# EAGLE design Cansat2019_1516_Payload_SectionA_v02 (EAGLE 7.3.0)
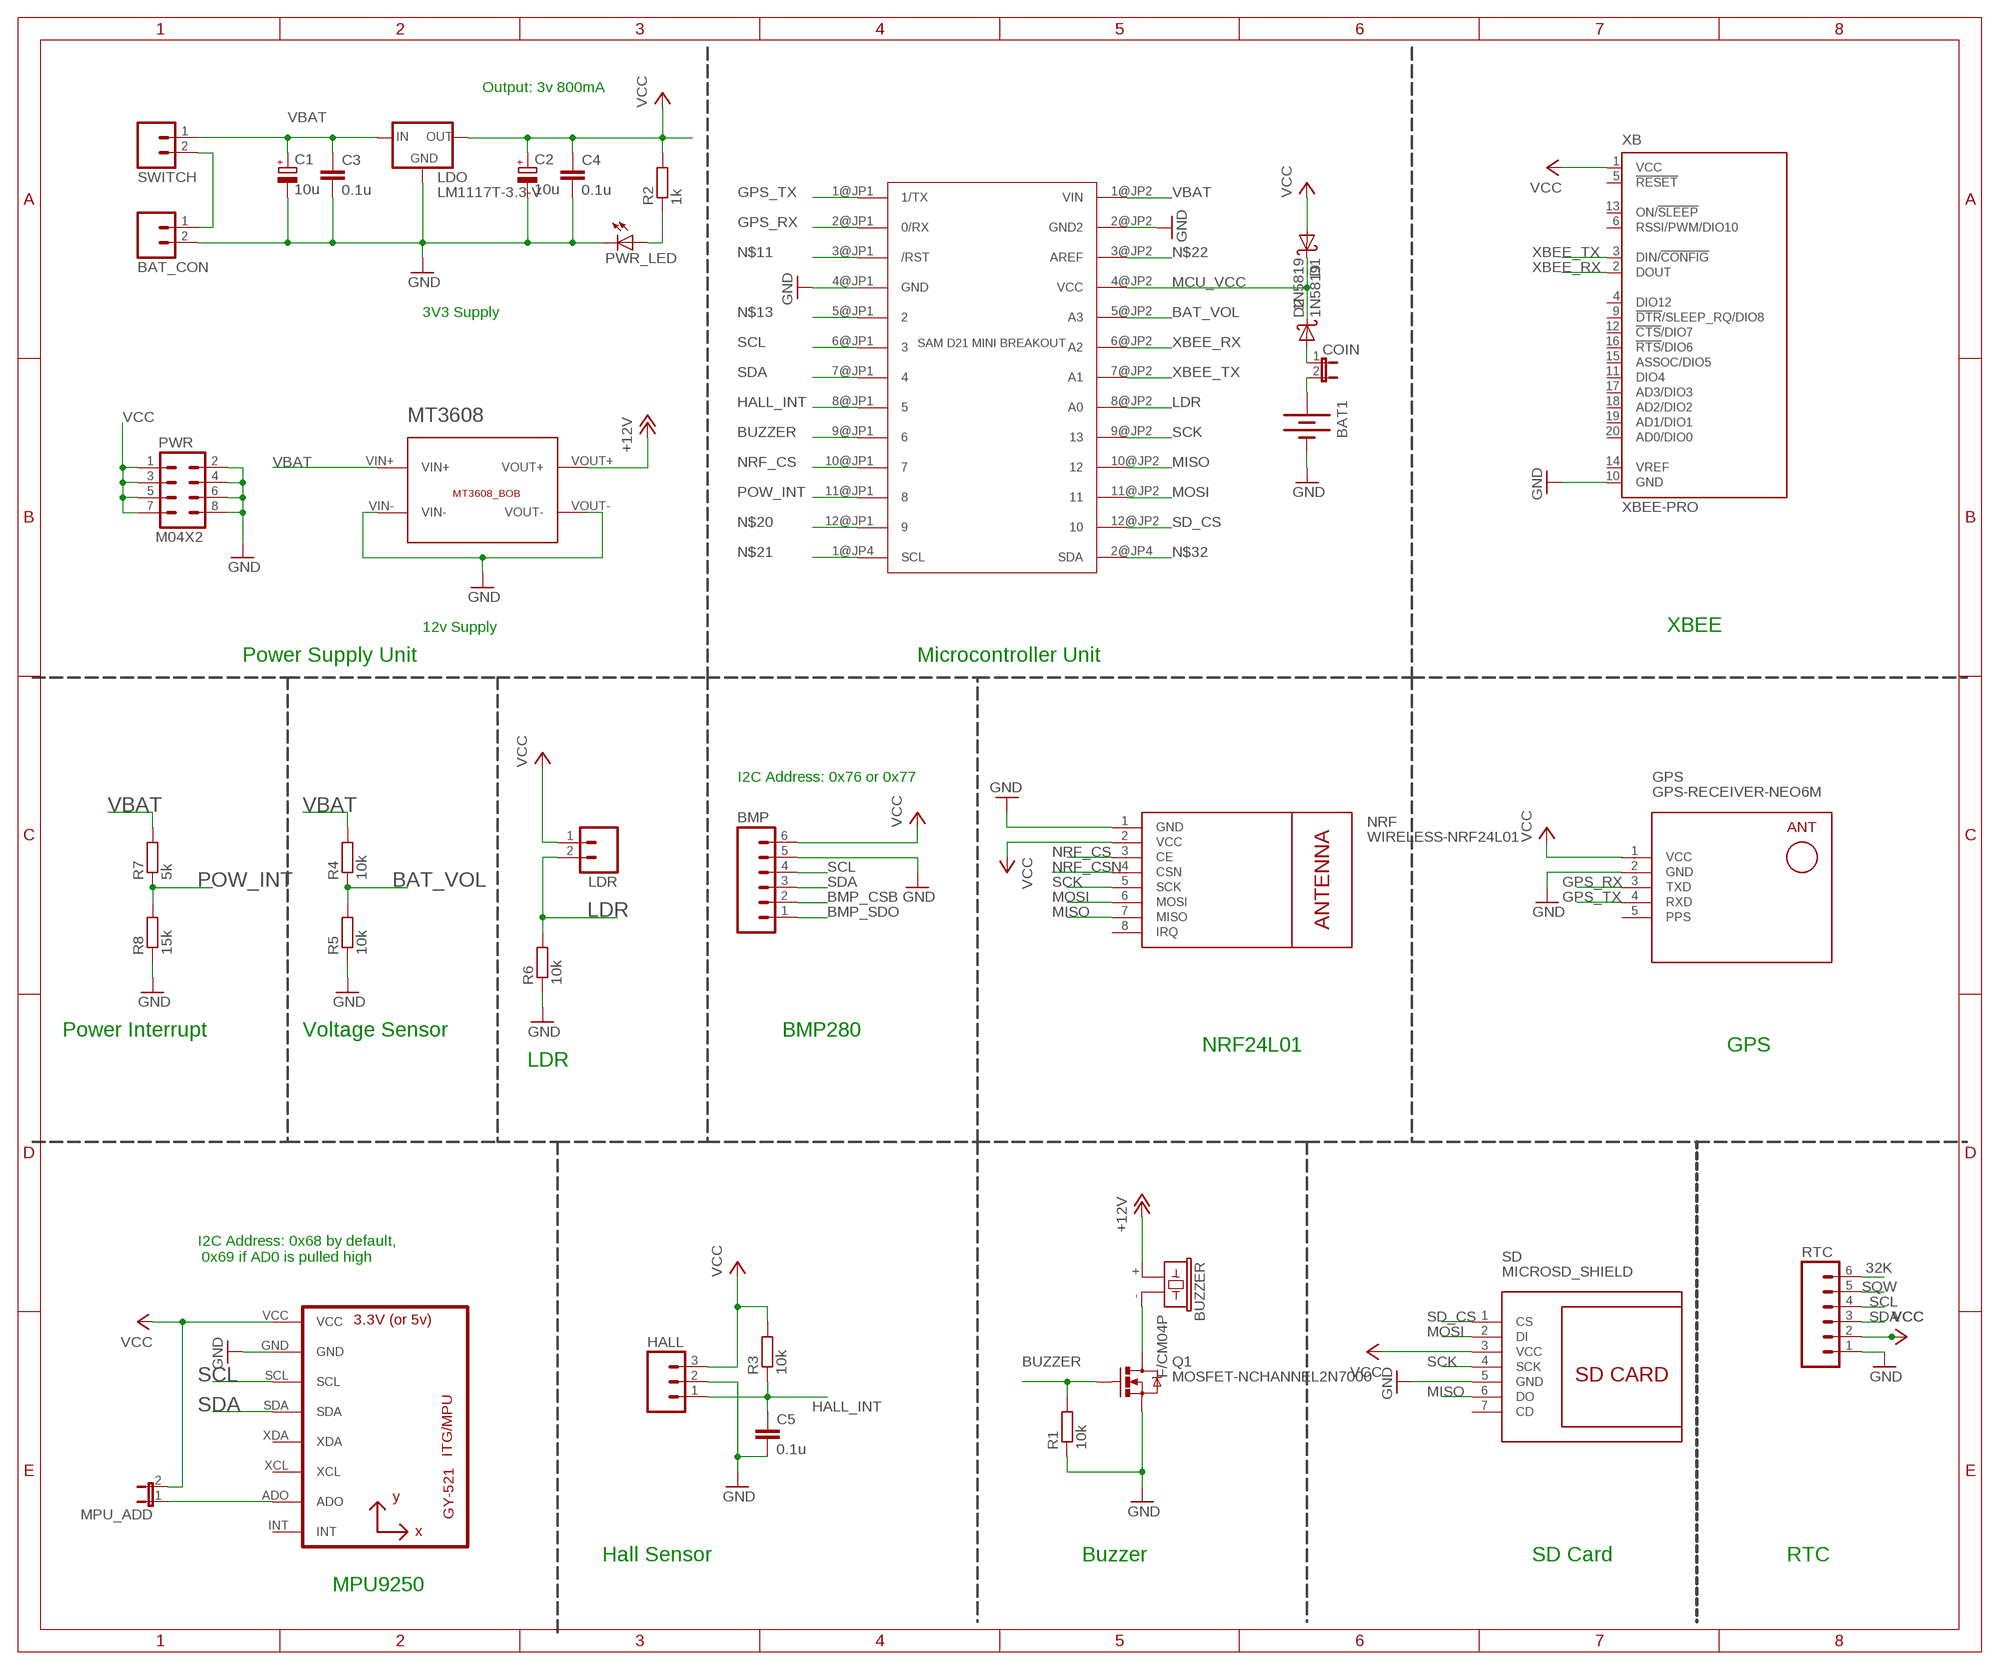
[diagram p0: schematic, sheet 1]

## Parts
BAT1  BATTERY20PTH  [BATTCOM_20MM_PTH]
BAT_CON  M02  [02P]
BMP  M06  [06P]
BUZZER  F/CM04P  [F/CM04P]
C1  10u  CPOL-EUE2.5-6  [E2,5-6]
C2  10u  CPOL-EUE2.5-6  [E2,5-6]
C3  0.1u  C-EU025-025X050  [C025-025X050]
C4  0.1u  C-EU025-025X050  [C025-025X050]
C5  0.1u  C-EU025-025X050  [C025-025X050]
COIN  JUMPER-2PTH  [1X02]
D1  1N5819  [DO41-10]
D2  1N5819  [DO41-10]
GPS  GPS-RECEIVER-NEO6M  [GPS-RECEIVER-NEO6M]
HALL  M03  [03P]
LDO  LM1117T-3.3-V  [TO220V]
LDR  M02  [02P]
MPU  GY-521MPU6050  [GY-521]
MPU_ADD  JUMPER-2PTH  [1X02]
MT3608  MT3608_BOB  [MT3608_BOB]
NRF  WIRELESS-NRF24L01  [WIRELESS-NRF24L01]
PWR  M04X2  [2X4]
PWR_LED  LED3MM  [LED3MM]
Q1  MOSFET-NCHANNEL2N7000  [TO-92]
R1  10k  R-EU_0204/7  [0204/7]
R2  1k  R-EU_0204/7  [0204/7]
R3  10k  R-EU_0204/7  [0204/7]
R4  10k  R-EU_0204/7  [0204/7]
R5  10k  R-EU_0204/7  [0204/7]
R6  10k  R-EU_0204/7  [0204/7]
R7  5k  R-EU_0204/7  [0204/7]
R8  15k  R-EU_0204/7  [0204/7]
RTC  M06  [06P]
SAMD  SAM_D21_MINI_BREAKOUT  [JP1_SPARKFUN-SAMD21-MINI-BREAKOUT-V10]
SD  MICROSD_SHIELD  [MICROSD_SHIELD]
SWITCH  M02  [02P]
XB  XBEE-PRO  [XBEE-PRO]

## Nets
32K: RTC.6
+12V [power]: BUZZER.+ MT3608.VOUT+
BAT_VOL: R4.1 R5.2 SAMD.5@JP2(A3)
BMP_CSB: BMP.2
BMP_SDO: BMP.1
BUZZER: Q1.2(G) R1.2 SAMD.9@JP1
GND [power]: BAT1.2(-) BAT_CON.2 BMP.5 C1.- C2.- C3.2 C4.2 C5.2 GPS.2(GND) HALL.2 LDO.1(GND) MPU.GND MT3608.VIN- MT3608.VOUT- NRF.1(GND) PWR.2 PWR.4 PWR.6 PWR.8 PWR_LED.K(C) Q1.1(S) R1.1 R5.1 R6.1 R8.1 RTC.1 SAMD.2@JP2(GND2) SAMD.4@JP1(GND) SD.5(GND) XB.10(GND)
GPS_RX: GPS.3(TXD) SAMD.2@JP1(0/RX)
GPS_TX: GPS.4(RXD) SAMD.1@JP1(1/TX)
HALL_INT: C5.1 HALL.1 R3.1 SAMD.8@JP1
LDR: LDR.2 R6.2 SAMD.8@JP2(A0)
MCU_VCC [power]: D1.C D2.C SAMD.4@JP2(VCC)
MISO: NRF.7(MISO) SAMD.10@JP2 SD.6(DO)
MOSI: NRF.6(MOSI) SAMD.11@JP2 SD.2(DI)
N$1: BUZZER.- Q1.3(D)
N$2 [power]: COIN.1 D2.A
N$3: PWR_LED.A R2.1
N$5 [power]: BAT1.1(+) COIN.2
N$6 [power]: BAT_CON.1 SWITCH.2
N$9: MPU.ADO MPU_ADD.1
N$11: SAMD.3@JP1(/RST)
N$13: SAMD.5@JP1
N$20: SAMD.12@JP1
N$21: SAMD.1@JP4(SCL)
N$22: SAMD.3@JP2(AREF)
N$32: SAMD.2@JP4(SDA)
NRF_CS: NRF.3(CE) SAMD.10@JP1
NRF_CSN: NRF.4(CSN)
POW_INT: R7.1 R8.2 SAMD.11@JP1
SCK: NRF.5(SCK) SAMD.9@JP2 SD.4(SCK)
SCL: BMP.4 MPU.SCL RTC.4 SAMD.6@JP1
SD_CS: SAMD.12@JP2 SD.1(CS)
SDA: BMP.3 MPU.SDA RTC.3 SAMD.7@JP1
SQW: RTC.5
VBAT [power]: C1.+ C3.1 LDO.3(IN) MT3608.VIN+ R4.2 R7.2 SAMD.1@JP2(VIN) SWITCH.1
VCC [power]: BMP.6 C2.+ C4.1 D1.A GPS.1(VCC) HALL.3 LDO.2(OUT) LDR.1 MPU.VCC MPU_ADD.2 NRF.2(VCC) PWR.1 PWR.3 PWR.5 PWR.7 R2.2 R3.2 RTC.2 SD.3(VCC) XB.1(VCC)
XBEE_RX: SAMD.6@JP2(A2) XB.2(DOUT)
XBEE_TX: SAMD.7@JP2(A1) XB.3(DIN/!CONFIG)
Unconnected: MPU.INT MPU.XCL MPU.XDA NRF.8(IRQ) SD.7(CD) XB.4(DIO12) XB.5(!RESET) XB.6(RSSI/PWM/DIO10) XB.9(!DTR!/SLEEP_RQ/DIO8) XB.11(DIO4) XB.12(!CTS!/DIO7) XB.13(ON/!SLEEP) XB.14(VREF) XB.15(ASSOC/DIO5) XB.16(!RTS!/DIO6) XB.17(AD3/DIO3) XB.18(AD2/DIO2) XB.19(AD1/DIO1) XB.20(AD0/DIO0)

## Notes on the sheet
- Output: 3v 800mA
- 3V3 Supply
- 12v Supply | XBEE
- Power Supply Unit | Microcontroller Unit
- I2C Address: 0x76 or 0x77
- Power Interrupt | Voltage Sensor | BMP280
- NRF24L01 | GPS
- LDR
- I2C Address: 0x68 by default,
   0x69 if AD0 is pulled high
- Hall Sensor | Buzzer | SD Card | RTC
- MPU9250

## Power pins joined to a net without a drawn wire
PPS: GPS.5(PPS)

## Library data of the parts
BAT1 = MSP-MB_V12:BATTERY: Battery Holders Various common sizes : AA, AAA, 18650 (PRT-12895), 20mm coin cell and 12mm coin cell. 20MM_4LEGS, BATT-10373
BAT_CON LDR SWITCH = CEDT_JANUARY_2015_v5:M02: AMP QUICK CONNECTOR
BMP RTC = con-amp-quick:M06: AMP QUICK CONNECTOR; OC_FARNELL: unknown; OC_NEWARK: unknown
BUZZER = buzzer:F/CM04P: BUZZER Source: Buerklin; OC_FARNELL: unknown; OC_NEWARK: unknown
C1 C2 = rcl:CPOL-EU: POLARIZED CAPACITOR, European symbol
C3-C5 = rcl:C-EU: CAPACITOR, European symbol
COIN MPU_ADD = SparkFun-Retired:JUMPER-2: Jumper Basic 0.1" spaced jumper. Use with breakaway headers.
D1 D2 = CEDT_JANUARY_2015_v6 (2):1N5819: DIODE general purpose rectifier, 1 A
GPS = diy-modules:GPS-RECEIVER-NEO6M: GPS Receiver Module based on NEO-6 device Short tutorial how to use NEO-6 module with Arduino: http://www.xarg.org/2016/06/neo6mv2-gps-module-with-arduino/ NEO-6 datasheet is available here: https://www.u-blox.com/sites/default/files/products/documents/NEO-6_DataSheet_%28GPS.G6-HW-09005%29.pdf Click here to find device on ebay.com <http://www.ebay.com/sch/gyneo6mv2>
HALL = msp framework:M03: AMP QUICK CONNECTOR
LDO = lm1117:LM1117T-*
MPU = gy-521:GY-521
MT3608 = Breakouts:MT3608_BOB
NRF = diy-modules:WIRELESS-NRF24L01: 2.4 GHz Wireless Module based on NRF24L01 chip More details available here: http://www.electrodragon.com/w/NRF24L01 Click here to find device on ebay.com <http://www.ebay.com/sch/nrf24l01+arduino>
PWR = SparkFun-Connectors:M04X2: .1" header, two rows of four.
PWR_LED = 01_adafruit:LED: LED OSRAM: - CHIPLED LG R971, LG N971, LY N971, LG Q971, LY Q971, LO R971, LY R971 LH N974, LH R974 LS Q976, LO Q976, LY Q976 LO Q996 - Hyper CHIPLED LW Q18S LB Q993, LB Q99A, LB R99A - SideLED LS A670, LO A670, LY A670, LG A670, LP A670 LB A673, LV A673, LT A673, LW A673 LH A674 LY A675 LS A676, LA A676, LO A676, LY A676, LW A676 LS A679, LY A679, LG A679 - Hyper Micro SIDELED® LS Y876, LA Y876, LO Y876, LY Y876 LT Y87S - SmartLED LW L88C, LW L88S LB L89C, LB L89S, LG L890 LS L89K, LO L89K, LY L89K LS L896, LA L896, LO L896, LY L896 - TOPLED LS T670, LO T670, LY T670, LG T670, LP T670 LSG T670, LSP T670, LSY T670, LOP T670, LYG T670 LG T671, LOG T671, LSG T671 LB T673, LV T673, LT T673, LW T673 LH T674 LS T676, LA T676, LO T676, LY T676, LB T676, LH T676, LSB T676, LW T676 LB T67C, LV T67C, LT T67C, LS T67K, LO T67K, LY T67K, LW E67C LS E67B, LA E67B, LO E67B, LY E67B, LB E67C, LV E67C, LT E67C LW T67C LS T679, LY T679, LG T679 LS T770, LO T770, LY T770, LG T770, LP T770 LB T773, LV T773, LT T773, LW T773 LH T774 LS E675, LA E675, LY E675, LS T675 LS T776, LA T776, LO T776, LY T776, LB T776 LHGB T686 LT T68C, LB T68C - Hyper Mini TOPLED® LB M676 - Mini TOPLED Santana® LG M470 LS M47K, LO M47K, LY M47K Source: http://www.osram.convergy.de/
Q1 = SparkFun-DiscreteSemi:MOSFET-NCHANNEL: Common NMOSFET Parts MFG P/N Store ID Prod ID FDD8780 TRANS-09984 SI7820DN TRANS-11055 FDS6630A IC-08089 2N7002PW TRANS-11151 FQP30N06L COM-10213 TRANS-10060 BSS123LT1G TRANS-08345 BSS138 TRANS-00830 BS170 2N7000
R1-R8 = rcl:R-EU_: RESISTOR, European symbol
SAMD = SparkFun-SAMD21-Mini-Breakout:SAM_D21_MINI_BREAKOUT: SPARKFUN-SAMD21-MINI-BREAKOUT
SD = Breakouts:MICROSD_SHIELD
XB = xbee:XBEE: XBee (TM) /XBee-PRO(TM) OEM RF Modules Source: MaxStream, Inc. xbee_productmanual.pdf; MPN: XBP24-AWI-001; OC_FARNELL: 1337916; OC_NEWARK: 42M2667

## Net classes
0 default: width 0.305 mm
1 power: width 0.61 mm, clearance 0.305 mm

## Board
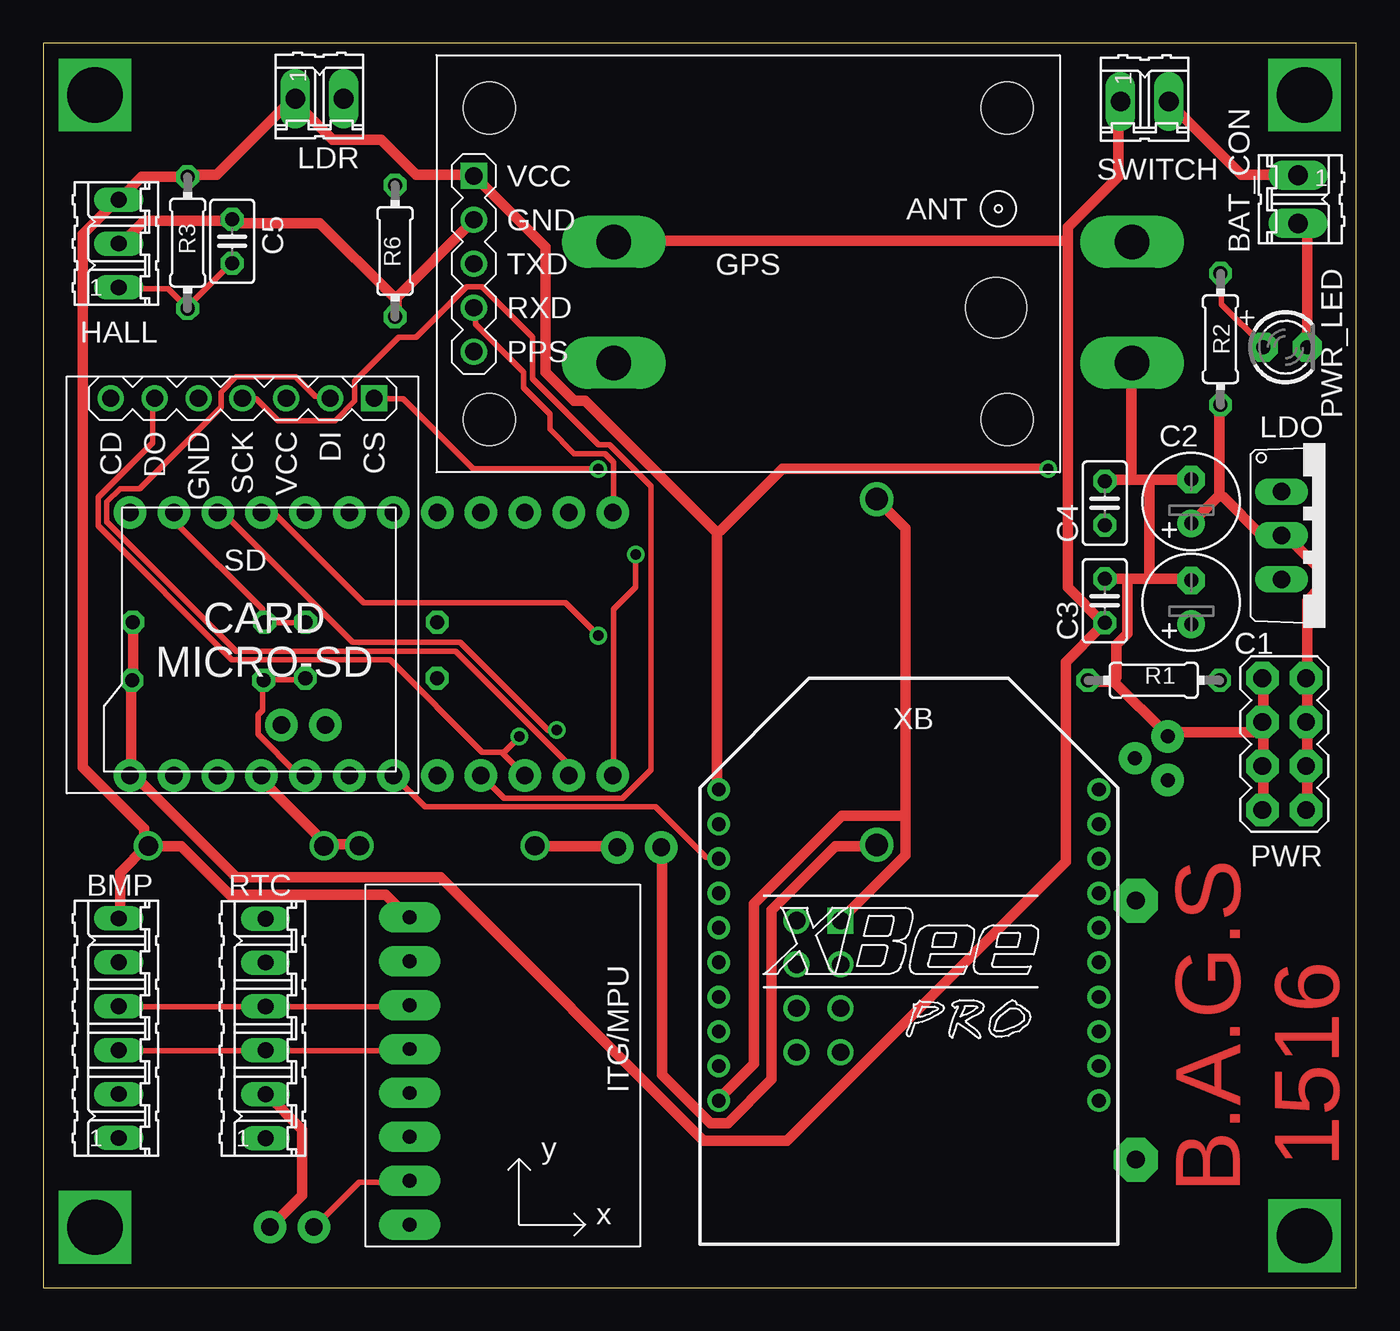
[diagram p1: board, top side]
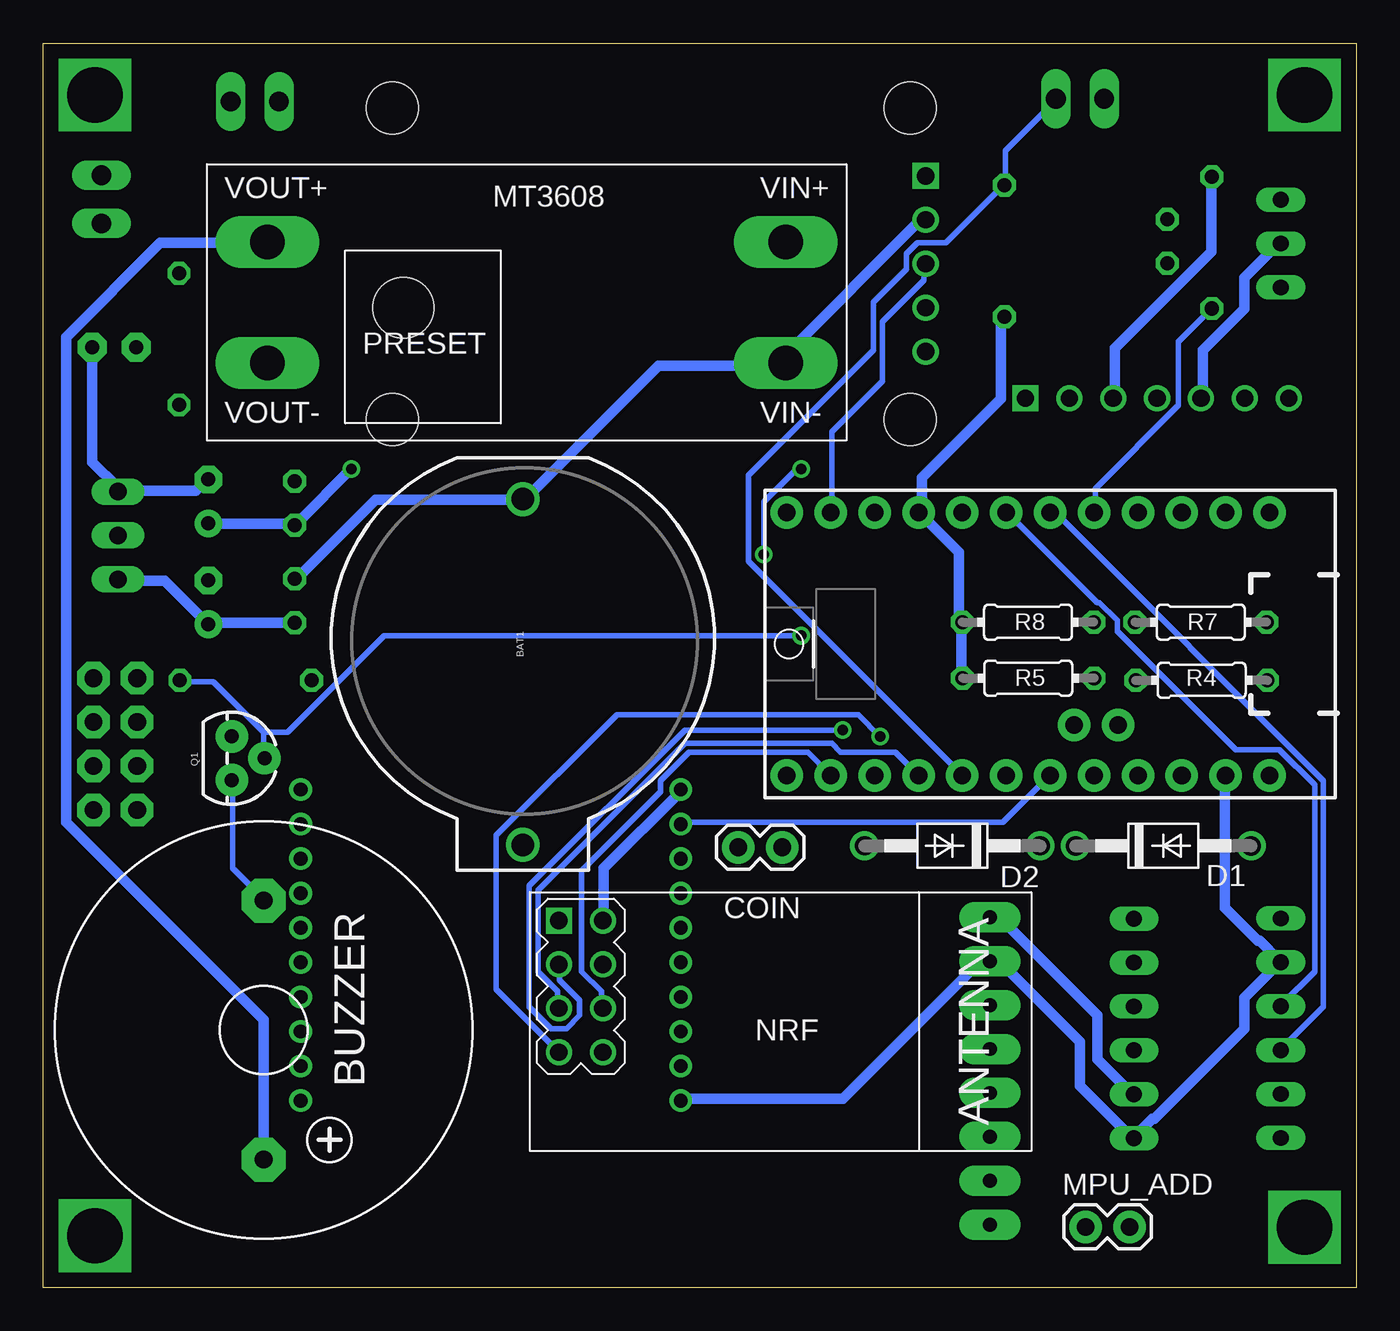
[diagram p2: board, bottom side, seen from below]

Size 76 x 72 mm. Coordinates in mm from the lower left corner, seen from the top.
Outline: 0,0 76,0 76,72 0,72 0,0
Copper layers (1*16): Top 0.035mm / dielectric 1.5mm / Bottom 0.035mm
Design rules "default": minimum track width 10mil, minimum drill 24mil, track to track 8mil, track to pad 8mil, pad to pad 8mil, via to via 8mil, smd to smd 8mil, copper to edge 40mil, drill to drill 8mil, minimum pad ring 10mil, minimum via ring 8mil, stop-mask expansion 4mil, vias tented up to drill 0mil, thermal gap 10mil

### Footprints (pad centres in the part's own frame; a part is rotated, then mirrored left to right if it is on the bottom)
BATTCOM_20MM_PTH = drill 1.3: 1 11.85,0; 2 -8.15,0
02P = drill 1.143 long: 1 -1.397,0; 2 1.397,0
06P = drill 0.914 long: 1 -6.35,0; 2 -3.81,0; 3 -1.27,0; 4 1.27,0; 5 3.81,0; 6 6.35,0
F/CM04P = drill 1.016 pad 2.54 octagon: + 7.493,0; - -7.493,0
E2,5-6 = drill 0.813 pad 1.6: + -1.27,0 | drill 0.813 pad 1.6 octagon: - 1.27,0
C025-025X050 = drill 0.813 octagon: 1 -1.27,0; 2 1.27,0
1X02 = drill 1.016 pad 1.88: 1 0,0; 2 2.54,0
DO41-10 = drill 1.118: A 5.08,0; C -5.08,0
GPS-RECEIVER-NEO6M = drill 1 square: 1 -15.875,5.08 | drill 1: 2 -15.875,2.54; 3 -15.875,0; 4 -15.875,-2.54; 5 -15.875,-5.08 | hole 3: -14.986,9.017; -14.986,-9.017; 14.986,-9.017; 14.986,9.017 | hole 3.5: 14.351,-2.54
03P = drill 0.914 long: 1 -2.54,0; 2 0,0; 3 2.54,0
TO220V = drill 1.016 long: 1 -2.54,-2.54; 2 0,-2.54; 3 2.54,-2.54
GY-521 = drill 0.8 pad 1.778 long: ADO -8.89,-6.35; GND -8.89,6.35; INT -8.89,-8.89; SCL -8.89,3.81; SDA -8.89,1.27; VCC -8.89,8.89; XCL -8.89,-3.81; XDA -8.89,-1.27
MT3608_BOB = drill 2 pad 3 long: VIN+ 33.5,-4.5; VIN- 33.5,-11.5; VOUT+ 3.5,-4.5; VOUT- 3.5,-11.5
WIRELESS-NRF24L01 = drill 1 square: 1 -12.7,6.35 | drill 1: 2 -10.16,6.35; 3 -12.7,3.81; 4 -10.16,3.81; 5 -12.7,1.27; 6 -10.16,1.27; 7 -12.7,-1.27; 8 -10.16,-1.27
2X4 = drill 1.016 pad 1.88 octagon: 1 -3.81,-1.27; 2 -3.81,1.27; 3 -1.27,-1.27; 4 -1.27,1.27; 5 1.27,-1.27; 6 1.27,1.27; 7 3.81,-1.27; 8 3.81,1.27
LED3MM = drill 0.813 pad 1.676 octagon: A -1.27,0; K 1.27,0
TO-92 = drill 0.813 pad 1.88: 1 -1.27,0; 2 0,1.905; 3 1.27,0
0204/7 = drill 0.813 octagon: 1 -3.81,0; 2 3.81,0
JP1_SPARKFUN-SAMD21-MINI-BREAKOUT-V10 = drill 1.016 pad 1.88: 1@JP1 1.27,1.27; 1@JP2 16.51,29.21; 1@JP4 13.589,17.907; 2@JP1 1.27,3.81; 2@JP2 16.51,26.67; 2@JP4 13.589,20.447; 3@JP1 1.27,6.35; 3@JP2 16.51,24.13; 4@JP1 1.27,8.89; 4@JP2 16.51,21.59; 5@JP1 1.27,11.43; 5@JP2 16.51,19.05; 6@JP1 1.27,13.97; 6@JP2 16.51,16.51; 7@JP1 1.27,16.51; 7@JP2 16.51,13.97; 8@JP1 1.27,19.05; 8@JP2 16.51,11.43; 9@JP1 1.27,21.59; 9@JP2 16.51,8.89; 10@JP1 1.27,24.13; 10@JP2 16.51,6.35; 11@JP1 1.27,26.67; 11@JP2 16.51,3.81; 12@JP1 1.27,29.21; 12@JP2 16.51,1.27
MICROSD_SHIELD = drill 1 square: 1 1.27,17.78 | drill 1: 2 1.27,15.24; 3 1.27,12.7; 4 1.27,10.16; 5 1.27,7.62; 6 1.27,5.08; 7 1.27,2.54
XBEE-PRO = drill 0.8 pad 1.27: 1 -11,9; 2 -11,7; 3 -11,5; 4 -11,3; 5 -11,1; 6 -11,-1; 7 -11,-3; 8 -11,-5; 9 -11,-7; 10 -11,-9; 11 11,-9; 12 11,-7; 13 11,-5; 14 11,-3; 15 11,-1; 16 11,1; 17 11,3; 18 11,5; 19 11,7; 20 11,9

### Placement (x,y rotation side)
BAT1  48.24,37.47 270 bottom
BAT_CON  72.63,62.97 270 top
BMP  4.37,15.01 90 top
BUZZER  63.24,14.9 270 bottom
C1  66.44,39.65 90 top
C2  66.44,45.49 90 top
C3  61.44,39.74 90 top
C4  61.44,45.39 90 top
C5  10.94,60.54 90 top
COIN  33.23,25.48 180 bottom
D1  11.17,25.56 0 bottom
D2  23.38,25.57 180 bottom
GPS  40.8,59.24 0 top
HALL  4.37,60.41 90 top
LDO  74.21,43.52 270 top
LDR  15.99,68.79 0 top
MPU  30.09,12.54 0 top
MPU_ADD  15.67,3.52 0 bottom
MT3608  66.52,65.01 0 bottom
NRF  33.45,14.89 0 bottom
PWR  71.83,31.45 90 top
PWR_LED  71.9,54.41 0 top
Q1  65.09,30.63 270 bottom
R1  64.28,35.14 0 top
R2  68.14,54.88 270 top
R3  8.36,60.46 90 top
R4  8.95,35.14 0 bottom
R5  18.98,35.27 0 bottom
R6  20.36,59.98 90 top
R7  9,38.5 0 bottom
R8  19,38.5 0 bottom
RTC  12.87,15 90 top
SAMD  34.23,46.13 270 bottom
SD  1.37,52.73 270 top
SWITCH  63.75,68.63 0 top
XB  50.1,19.82 0 top

### Tracks (layer width: path | path; a pad name or v marks a point on that pad's centre or on a via)
+12V
  Bottom 0.61: BUZZER.+ 63.25,7.49 63.25,15.49 74.68,26.92 74.68,54.99 69.22,60.45 63.12,60.45 MT3608.VOUT+
BAT_VOL
  Top 0.305: R5.2 15.11,35.18 12.83,35.18 R4.1 12.7,35.05 12.7,33.4 12.45,33.15 12.45,32 14.73,29.72 15.11,29.72 SAMD.5@JP2
BUZZER  (via drill 0.61)
  Top 0.305: v32.13,37.72 30.23,39.62 18.54,39.62 13.34,44.83 12.7,44.83 SAMD.9@JP1
  Bottom 0.305: 63.25,32.13 66.17,35.05 68.07,35.05 R1.2 | 63.25,32.13 63.25,30.73 Q1.2 | v32.13,37.72 56.26,37.72 61.85,32.13 63.25,32.13
GND
  Top 0.61: HALL.2 4.45,60.33 5.84,61.72 10.92,61.72 C5.2 11.18,61.59 16,61.59 20.19,57.4 20.45,57.28 | 20.45,57.28 20.45,56.26 R6.1 | 20.45,57.28 24.89,61.72 GPS.2 | 49.91,27.3 49.91,43.94 48.26,45.59 BAT1.2 | 49.91,27.3 49.91,25.02 46.23,21.34 NRF.1 | 61.98,35.05 60.58,35.05 R1.1 | 61.98,35.05 65.02,32 Q1.1 65.28,32.13 70.36,32.13 PWR.6 | PWR.2 70.61,27.69 70.61,30.1 PWR.4 70.61,30.48 70.61,32.64 PWR.6 | PWR.8 70.61,35.18 70.61,33.02 PWR.6 | PWR_LED.K 73.15,54.48 73.15,60.96 72.64,61.47 BAT_CON.2 | 64.01,41.02 66.42,41.02 C1.- | 64.01,41.02 62.74,41.02 | 62.74,41.02 61.47,41.02 C3.2 | 64.01,46.74 66.42,46.74 C2.- | 64.01,46.74 62.99,46.74 | 62.99,46.74 61.47,46.74 C4.2 | 64.01,46.74 64.01,41.02 | 62.99,46.74 62.99,53.47 MT3608.VOUT- | 62.74,41.02 62.74,37.85 62.1,37.21 62.1,35.31 61.98,35.05 | 49.91,27.3 46.23,27.3 41.15,22.23 41.15,12.95 39.12,10.92 XB.10
  Bottom 0.61: SD.5 8.89,51.56 8.89,54.23 6.48,56.64 6.48,58.42 4.45,60.45 HALL.2 | R5.1 22.86,35.31 22.86,38.48 R8.1 22.99,38.73 22.99,42.55 25.27,44.83 SAMD.4@JP1 25.15,45.09 25.15,46.86 20.57,51.44 20.57,56.01 20.45,56.13 R6.1 | GPS.2 25.02,61.72 25.27,61.72 33.02,53.98 MT3608.VIN- 33.27,53.34 40.39,53.34 48.01,45.72 BAT1.2 48.26,45.59 56.77,45.59 61.34,41.02 C3.2 | XB.10 38.99,10.92 29.72,10.92 21.84,18.8 21.21,18.8 MPU.GND 20.95,18.67 20.45,18.67 16,14.22 16,11.68 13.08,8.76 RTC.1 12.83,8.76 11.81,9.78 11.68,9.78 6.48,14.99 6.48,16.76 4.57,18.67 BMP.5 4.45,18.92 5.59,20.07 5.71,20.07 7.62,21.97 7.62,29.59 SAMD.2@JP2 | C2.- 66.55,46.74 67.18,46.1 71.63,46.1 LDO.1 71.75,46.35 73.15,47.75 73.15,54.36 PWR_LED.K
GPS_RX
  Bottom 0.305: GPS.3 25.02,59.18 25.02,58.29 27.43,55.88 27.43,52.45 30.35,49.53 30.35,44.96 SAMD.2@JP1
GPS_TX
  Top 0.305: GPS.4 25.02,56.64 25.02,55.75 27.81,52.96 27.81,52.07 29.34,50.55 29.34,49.66 30.73,48.26 32.51,48.26 33.02,47.75 33.02,44.96 SAMD.1@JP1
HALL_INT
  Top 0.305: C5.1 10.92,59.31 8.38,56.77 R3.1 8.26,56.77 7.24,57.78 4.45,57.78 HALL.1
  Bottom 0.305: SAMD.8@JP1 15.11,44.96 15.11,46.23 10.29,51.05 10.29,54.74 8.38,56.64 R3.1
LDR
  Bottom 0.305: LDR.2 17.4,68.71 20.32,65.79 20.32,63.88 R6.2 20.45,63.75 23.75,60.45 25.4,60.45 26.04,59.82 26.04,58.93 27.94,57.02 27.94,54.23 35.18,46.99 35.18,42.04 22.86,29.72 SAMD.8@JP2
MCU_VCC
  Top 0.61: D2.C 18.29,25.65 16.26,25.65 D1.C 16.13,25.91 12.7,29.34 12.7,29.59 SAMD.4@JP2
MISO  (via drill 0.61)
  Top 0.305: 26.54,30.99 25.4,30.99 20.07,36.32 10.92,36.32 3.17,44.07 3.17,45.72 6.35,48.9 6.35,51.44 SD.6 | 26.54,30.99 27.81,29.72 SAMD.10@JP2 | v27.56,31.88 26.67,30.99 26.54,30.99
  Bottom 0.305: v27.56,31.88 28.83,33.15 42.8,33.15 49.78,26.16 49.78,17.27 46.23,13.72 NRF.7
MOSI
  Top 0.305: SD.2 16.51,51.56 15.75,51.56 14.61,52.7 11.18,52.7 10.29,51.82 10.29,50.93 5.59,46.23 4.45,46.23 3.68,45.47 3.68,44.32 11.18,36.83 23.88,36.83 30.35,30.35 30.35,29.72 SAMD.11@JP2
  Bottom 0.305: NRF.6 43.69,16.26 43.69,17.14 44.83,18.29 44.83,24.13 40.26,28.7 40.26,29.34 38.61,30.99 31.75,30.99 30.48,29.72 SAMD.11@JP2
N$1
  Bottom 0.305: Q1.3 65.02,29.34 65.02,24.26 63.25,22.48 BUZZER.-
N$2
  Top 0.61: D2.A 28.57,25.53 33.15,25.53 COIN.1
N$3
  Top 0.305: R2.1 68.2,58.67 68.2,56.9 70.61,54.48 PWR_LED.A
N$4  (via drill 3.2)
  other vias: 3,69
N$5
  Top 0.61: COIN.2 35.81,25.4 35.81,12.32 38.61,9.53 39.62,9.53 42.16,12.06 42.16,21.84 45.85,25.53 48.13,25.53 BAT1.1
N$6
  Top 0.61: BAT_CON.1 72.52,64.39 69.34,64.39 65.15,68.58 SWITCH.2
N$7  (via drill 3.2)
  other vias: 3,3.5
N$8  (via drill 3.2)
  other vias: 73,3
N$9
  Top 0.305: MPU.ADO 21.08,6.1 18.29,6.1 15.75,3.56 MPU_ADD.1
N$10  (via drill 3.2)
  other vias: 73,69
NRF_CS  (via drill 0.61)
  Top 0.305: v29.72,32.26 29.21,32.26 24.13,37.34 17.91,37.34 10.41,44.83 10.16,44.83 SAMD.10@JP1
  Bottom 0.305: v29.72,32.26 38.86,32.26 47.88,23.24 47.88,16.26 46.61,14.99 45.72,14.99 44.96,15.75 44.96,16.64 46.1,17.78 46.1,18.67 NRF.3
POW_INT
  Top 0.305: R8.2 15.11,38.48 12.83,38.48 R7.1 12.7,38.61 12.7,39.24 7.62,44.32 7.62,44.83 SAMD.11@JP1
SCK
  Top 0.305: SD.4 11.56,51.44 12.32,51.44 13.59,50.16 16.89,50.16 18.03,51.31 18.03,52.45 20.57,54.99 21.59,54.99 24.51,57.91 25.4,57.91 28.32,54.99 28.32,52.58 32.13,48.77 32.77,48.77 35.18,46.35 35.18,29.97 33.53,28.32 26.67,28.32 25.4,29.59 SAMD.9@JP2
  Bottom 0.305: NRF.5 46.23,16.26 46.23,17.14 47.37,18.29 47.37,22.99 38.86,31.5 30.35,31.5 29.84,30.99 26.67,30.99 25.4,29.72 SAMD.9@JP2
SCL
  Top 0.305: MPU.SCL 21.08,16.26 12.95,16.26 RTC.4 12.83,16.26 4.45,16.26 BMP.4
  Bottom 0.305: SAMD.6@JP1 20.19,44.83 14.99,39.62 14.86,39.62 13.84,38.61 13.84,37.97 6.99,31.11 4.45,31.11 2.41,29.08 2.41,18.29 4.32,16.38 BMP.4
SD_CS  (via drill 0.61)
  Top 0.305: v32.13,47.37 24.89,47.37 20.83,51.44 19.18,51.44 SD.1 | v34.29,42.42 34.29,40.51 33.02,39.24 33.02,29.72 SAMD.12@JP2
  Bottom 0.305: v32.13,47.37 32.38,47.37 34.29,45.47 v34.29,42.42
SDA
  Top 0.305: MPU.SDA 21.08,13.72 12.95,13.72 RTC.3 12.83,13.72 4.45,13.72 BMP.3
  Bottom 0.305: SAMD.7@JP1 17.65,44.83 17.4,44.83 1.91,29.34 1.91,16.26 4.32,13.84 BMP.3
VBAT
  Top 0.61: R7.2 5.21,38.48 5.21,35.18 R4.2 5.08,34.92 5.08,29.72 SAMD.1@JP2 5.33,29.59 11.18,23.75 22.99,23.75 38.23,8.51 43.05,8.51 59.18,24.64 59.18,36.2 61.21,38.23 C3.1 61.34,38.48 59.31,40.51 59.31,60.58 | 59.31,60.58 59.31,61.34 62.23,64.26 62.23,68.58 SWITCH.1 | 59.31,60.58 33.02,60.58 MT3608.VIN+
  Bottom 0.61: C3.1 61.47,38.48 66.42,38.48 C1.+ 66.67,38.61 68.96,40.89 71.63,40.89 LDO.3
VCC  (via drill 0.61)
  Top 0.61: BMP.6 4.45,21.46 4.45,24 5.97,25.53 D1.A | RTC.2 12.95,11.18 14.99,9.14 14.99,5.33 13.21,3.56 MPU_ADD.2 | D1.A 6.35,25.53 8,25.53 10.79,22.73 19.81,22.73 21.08,21.46 MPU.VCC | PWR.1 73.15,27.69 73.15,30.1 PWR.3 73.15,30.48 73.15,32.64 PWR.5 73.15,33.02 73.15,35.18 PWR.7 73.15,35.56 73.15,39.75 73.91,40.51 73.91,41.53 71.88,43.56 LDO.2 71.63,43.56 70.48,43.56 68.33,45.72 68.07,45.85 | 68.07,45.85 68.07,51.05 R2.2 | 68.07,45.85 66.55,44.32 C2.+ | 38.99,43.69 38.99,28.83 XB.1 | 38.99,43.69 31.37,51.31 30.73,51.31 29.08,52.96 29.08,60.2 25.15,64.14 GPS.1 24.89,64.39 21.59,64.39 19.56,66.42 16.76,66.42 14.48,68.71 LDR.1 14.22,68.58 10.03,64.39 8.64,64.39 R3.2 8.26,64.26 5.71,64.26 4.45,62.99 HALL.3 4.19,62.87 2.29,60.96 2.29,30.1 5.84,26.54 5.84,25.78 D1.A | v58.17,47.37 42.8,47.37 39.24,43.81 38.99,43.69
  Bottom 0.61: MPU.VCC 21.08,21.34 20.57,21.34 14.99,15.75 14.99,13.21 12.95,11.18 RTC.2 | C2.+ 66.42,44.2 61.47,44.2 C4.1 61.21,44.32 v58.17,47.37 | SD.3 13.97,51.56 13.97,54.36 8.38,59.94 8.38,64.26 R3.2 | XB.1 39.12,28.7 43.56,24.26 43.56,21.34 NRF.2
XBEE_RX
  Bottom 0.305: XB.2 38.99,26.92 20.45,26.92 17.78,29.59 SAMD.6@JP2
XBEE_TX
  Top 0.305: XB.3 38.99,24.89 38.35,24.89 35.43,27.81 22.1,27.81 20.32,29.59 SAMD.7@JP2

### Text on the board
Top: B.A.G.S / 1516